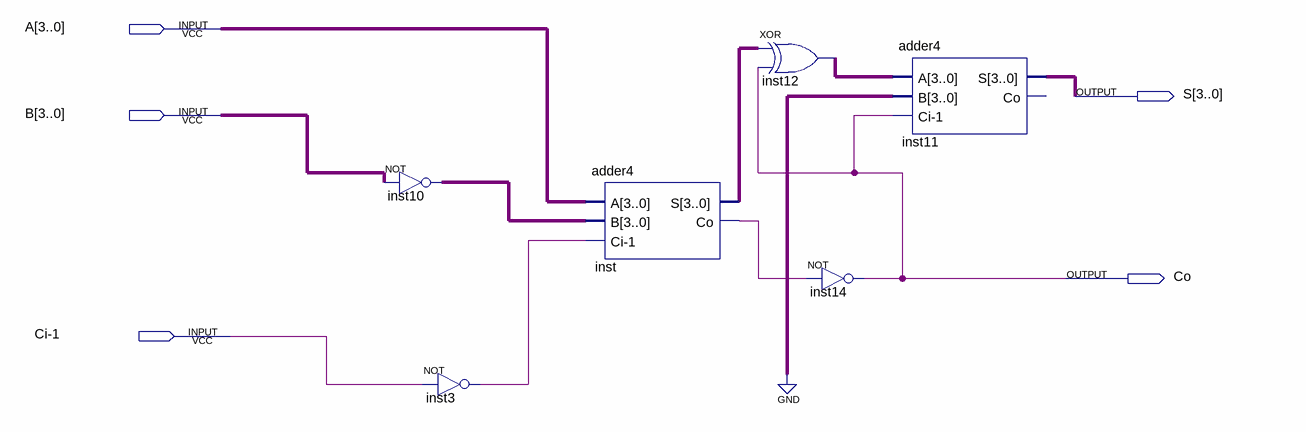
[diagram p0: schematic sheet]
// Quartus schematic plus4.bdf as structural Verilog: 6 symbols, 5 pins
module plus4 (
  input  [3:0] A,
  input  [3:0] B,
  input  \Ci-1 ,
  output [3:0] S,
  output Co
);

  wire inst3_out, inst_co;
  wire [3:0] inst10_out, inst12_out, inst_s;

  assign inst10_out = ~B;  // NOT inst10, 4 bits wide
  not inst3 (inst3_out, \Ci-1 );
  adder4 inst (.A(A), .B(inst10_out), .\Ci-1 (inst3_out), .S(inst_s), .Co(inst_co));
  assign inst12_out = inst_s ^ {4{Co}};  // XOR inst12, 4 bits wide
  not inst14 (Co, inst_co);
  adder4 inst11 (.A(inst12_out), .B(4'b0000), .\Ci-1 (Co), .S(S));  // open: Co
endmodule
